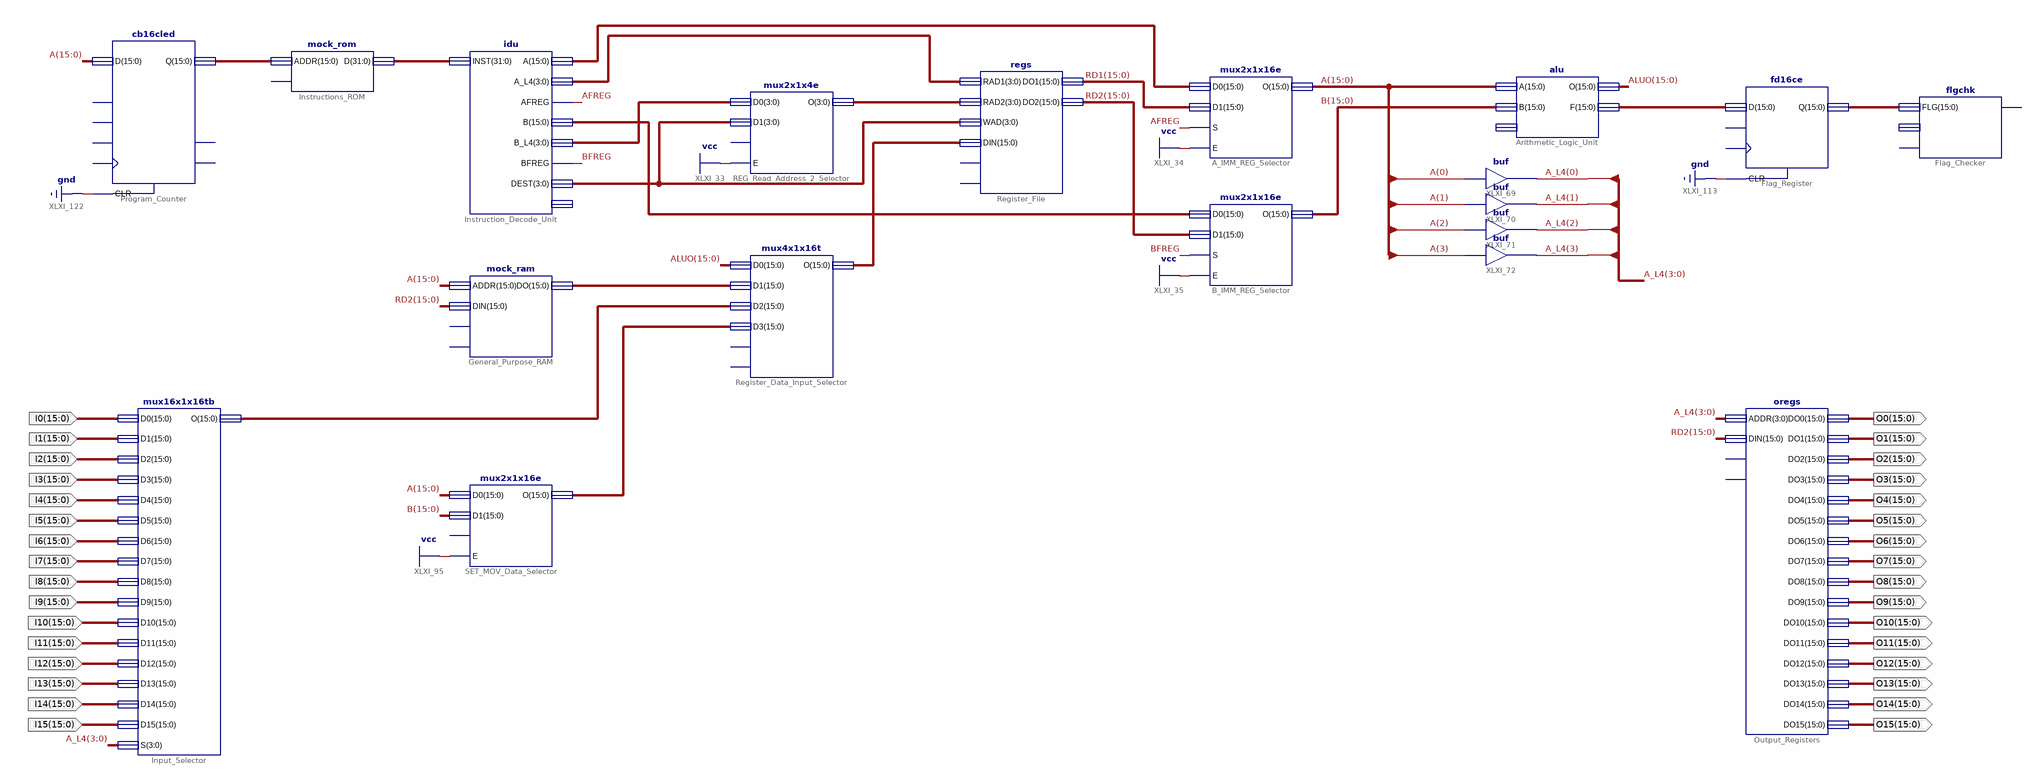
[diagram p0: schematic sheet 1]
// Xilinx ISE schematic cpu.sch (spartan6) as structural Verilog: 19 symbols, 32 ports
module cpu (
  input  [15:0] I0,
  input  [15:0] I1,
  input  [15:0] I10,
  input  [15:0] I11,
  input  [15:0] I12,
  input  [15:0] I13,
  input  [15:0] I14,
  input  [15:0] I15,
  input  [15:0] I2,
  input  [15:0] I3,
  input  [15:0] I4,
  input  [15:0] I5,
  input  [15:0] I6,
  input  [15:0] I7,
  input  [15:0] I8,
  input  [15:0] I9,
  output [15:0] O0,
  output [15:0] O1,
  output [15:0] O10,
  output [15:0] O11,
  output [15:0] O12,
  output [15:0] O13,
  output [15:0] O14,
  output [15:0] O15,
  output [15:0] O2,
  output [15:0] O3,
  output [15:0] O4,
  output [15:0] O5,
  output [15:0] O6,
  output [15:0] O7,
  output [15:0] O8,
  output [15:0] O9
);

  wire AFREG, BFREG;
  wire [3:0] A_L4, XLXN_49, XLXN_296, XLXN_303, XLXN_343;
  wire [15:0] A, ALUO, B, RD1, RD2, XLXN_1, XLXN_30, XLXN_32, XLXN_58, XLXN_59, XLXN_60, XLXN_113, XLXN_307,
       XLXN_324;
  wire [31:0] XLXN_86;

  mux4x1x16t Register_Data_Input_Selector (
    .D0(ALUO), .D1(XLXN_58), .D2(XLXN_59), .D3(XLXN_60), .O(XLXN_307));  // open: S0, S1
  mock_rom Instructions_ROM (.ADDR(XLXN_113), .D(XLXN_86));  // open: CLK
  cb16cled Program_Counter (.CLR(1'b0), .D(A), .Q(XLXN_113));  // open: C, CE, L, UP, CEO, TC
  mock_ram General_Purpose_RAM (.ADDR(A), .DIN(RD2), .DO(XLXN_58));  // open: CLK, WE
  mux2x1x16e A_IMM_REG_Selector (.D0(XLXN_30), .D1(RD1), .E(1'b1), .O(A), .S(AFREG));
  mux2x1x16e B_IMM_REG_Selector (.D0(XLXN_32), .D1(RD2), .E(1'b1), .O(B), .S(BFREG));
  alu Arithmetic_Logic_Unit (.A(A), .B(B), .F(XLXN_1), .O(ALUO));  // open: OP
  regs Register_File (
    .DIN(XLXN_307), .DO1(RD1), .DO2(RD2), .RAD1(XLXN_296), .RAD2(XLXN_343), .WAD(XLXN_49));  // open: CLK, WE
  idu Instruction_Decode_Unit (
    .A(XLXN_30), .AFREG(AFREG), .A_L4(XLXN_296), .B(XLXN_32), .BFREG(BFREG), .B_L4(XLXN_303), .DEST(XLXN_49),
    .INST(XLXN_86));  // open: ID
  buf XLXI_69 (A_L4[0], A[0]);
  buf XLXI_70 (A_L4[1], A[1]);
  buf XLXI_71 (A_L4[2], A[2]);
  buf XLXI_72 (A_L4[3], A[3]);
  fd16ce Flag_Register (.CLR(1'b0), .D(XLXN_1), .Q(XLXN_324));  // open: C, CE
  mux2x1x16e SET_MOV_Data_Selector (.D0(A), .D1(B), .E(1'b1), .O(XLXN_60));  // open: S
  oregs Output_Registers (
    .ADDR(A_L4), .DIN(RD2), .DO0(O0), .DO1(O1), .DO10(O10), .DO11(O11), .DO12(O12), .DO13(O13), .DO14(O14),
    .DO15(O15), .DO2(O2), .DO3(O3), .DO4(O4), .DO5(O5), .DO6(O6), .DO7(O7), .DO8(O8), .DO9(O9));  // open: CLK, WE
  mux2x1x4e REG_Read_Address_2_Selector (.D0(XLXN_303), .D1(XLXN_49), .E(1'b1), .O(XLXN_343));  // open: S
  flgchk Flag_Checker (.FLG(XLXN_324));  // open: E, FSTATE, IDX
  mux16x1x16tb Input_Selector (
    .D0(I0), .D1(I1), .D10(I10), .D11(I11), .D12(I12), .D13(I13), .D14(I14), .D15(I15), .D2(I2), .D3(I3),
    .D4(I4), .D5(I5), .D6(I6), .D7(I7), .D8(I8), .D9(I9), .O(XLXN_59), .S(A_L4));
endmodule
